# EAGLE design rpi-clock-33v (EAGLE 7.3.0)
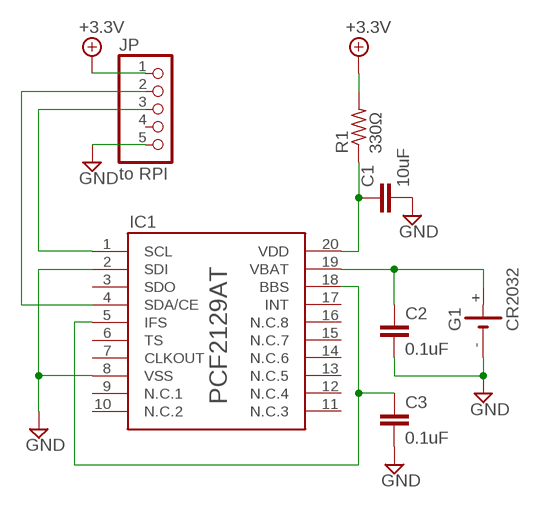
[diagram p0: schematic, sheet 1]

## Parts
C1  10uF  C-EUC0504  [C0504]
C2  0.1uF  C-EUC0504  [C0504]
C3  0.1uF  C-EUC0504  [C0504]
G1  CR2032  HU2032  [HU2032]
IC1  PCF2129AT  [SO20]
JP  to RPI  PINHD-1X5  [1X05]
R1  330Ω  R-US_M0805  [M0805]

## Nets
+3V: JP.1 R1.2 ; supply symbol labelled +3.3V
GND: C1.2 C2.2 C3.2 G1.- IC1.2(SDI) IC1.8(VSS) JP.5
N$1: C1.1 IC1.20(VDD) R1.1
N$2: C3.1 IC1.5(IFS) IC1.18(BBS)
N$10: C2.1 G1.+ IC1.19(VBAT)
N$35: IC1.1(SCL) JP.3
SCL: IC1.4(SDA/CE) JP.2
Unconnected: G1.+@2(+) IC1.3(SDO) IC1.6(TS) IC1.7(CLKOUT) IC1.9(N.C.1) IC1.10(N.C.2) IC1.11(N.C.3) IC1.12(N.C.4) IC1.13(N.C.5) IC1.14(N.C.6) IC1.15(N.C.7) IC1.16(N.C.8) IC1.17(INT) JP.4

## Library data of the parts
C1-C3 = rcl:C-EU: CAPACITOR, European symbol
G1 = takachi-battery-holder:HU2032: TAKACHI - Battery Holder - HU2032
IC1 = nxp_pcf212X:PCF2129AT: Accurate RTC with integrated quartz crystal for industrial applications
JP = pinhead:PINHD-1X5: PIN HEADER
R1 = rcl:R-US_: RESISTOR, American symbol

## Board
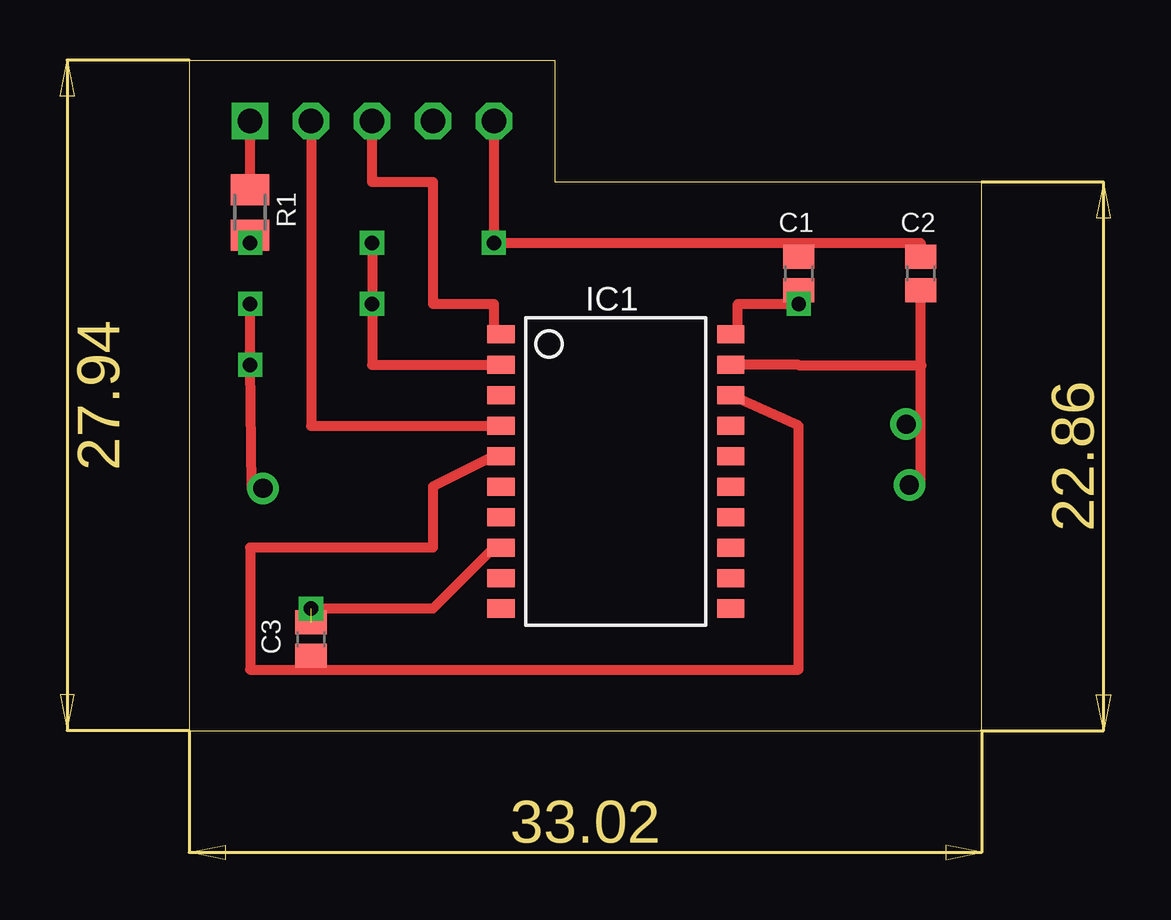
[diagram p1: board, top side]
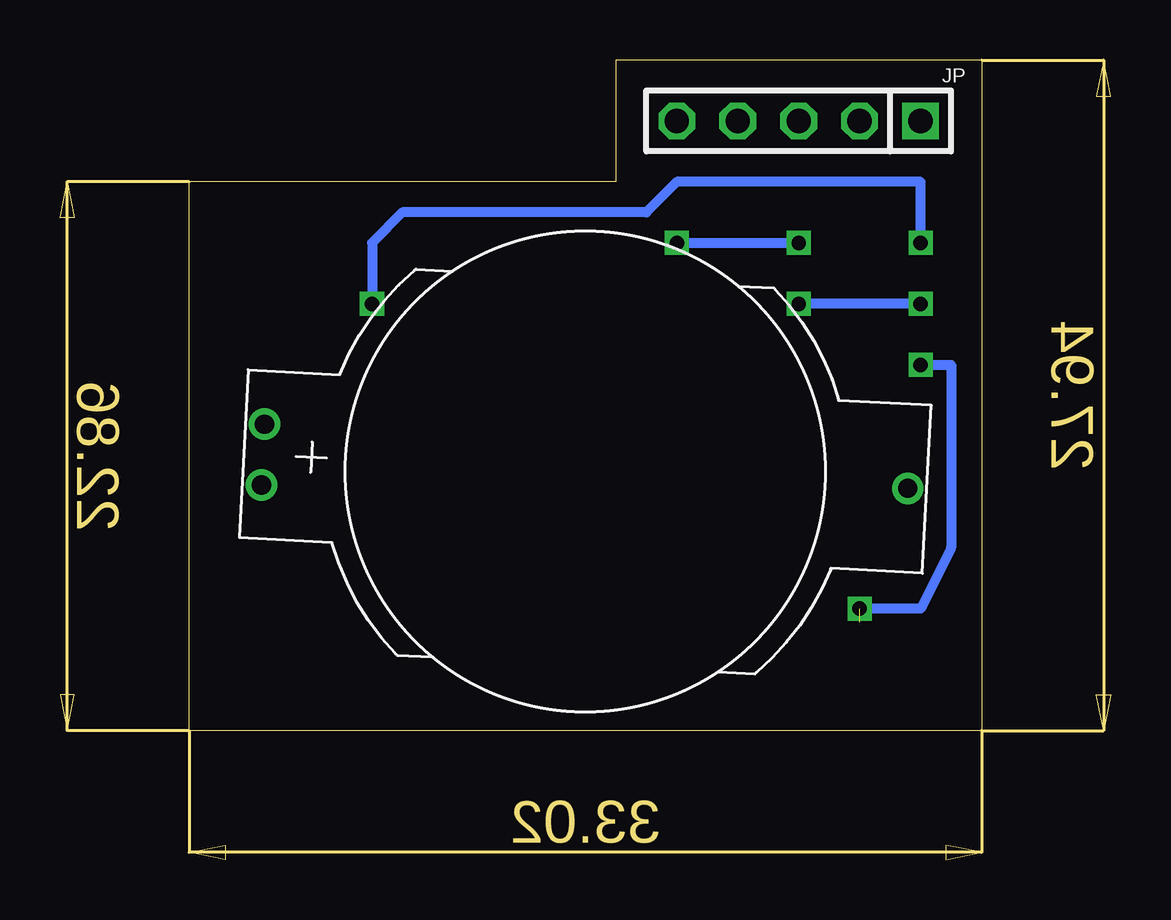
[diagram p2: board, bottom side, seen from below]

Size 33.02 x 27.94 mm. Coordinates in mm from the lower left corner, seen from the top.
Outline: 0,0 33.02,0 33.02,22.86 15.24,22.86 15.24,27.94 0,27.94 0,0
Copper layers (1*16): Top 0.035mm / dielectric 1.5mm / Bottom 0.035mm
Design rules "default *": minimum track width 10mil, minimum drill 23mil, track to track 8mil, track to pad 8mil, pad to pad 8mil, via to via 8mil, smd to smd 8mil, copper to edge 40mil, drill to drill 8mil, minimum pad ring 10mil, minimum via ring 8mil, stop-mask expansion 4mil, vias tented up to drill 0mil, thermal gap 10mil

### Footprints (pad centres in the part's own frame; a part is rotated, then mirrored left to right if it is on the bottom)
C0504 = smd 1 x 1.3: 1 -0.7,0; 2 0.7,0
HU2032 = drill 0.8: + -13.45,1.27; +@2 -13.45,-1.27; - 13.45,0
SO20 = smd 0.762 x 1.143: 1 -5.08,-4.788; 2 -3.81,-4.788; 3 -2.54,-4.788; 4 -1.27,-4.788; 5 0,-4.788; 6 1.27,-4.788; 7 2.54,-4.788; 8 3.81,-4.788; 9 5.08,-4.788; 10 6.35,-4.788; 11 6.35,4.788; 12 5.08,4.788; 13 3.81,4.788; 14 2.54,4.788; 15 1.27,4.788; 16 0,4.788; 17 -1.27,4.788; 18 -2.54,4.788; 19 -3.81,4.788; 20 -5.08,4.788
1X05 = drill 1.016 square: 1 -5.08,0 | drill 1.016 octagon: 2 -2.54,0; 3 0,0; 4 2.54,0; 5 5.08,0
M0805 = smd 1.3 x 1.6: 1 -0.95,0; 2 0.95,0

### Placement (x,y rotation side)
C1  25.4,19.05 90 top
C2  30.48,19.05 90 top
C3  5.08,3.81 90 top
G1  16.51,10.79 357 bottom
IC1  17.78,11.43 270 top
JP  7.62,25.4 180 bottom
R1  2.54,21.59 90 top

### Tracks (layer width: path | path; a pad name or v marks a point on that pad's centre or on a via)
+3V
  Top 0.406: R1.2 JP.1
GND  (via drill 0.6)  (1 unrouted)
  Top 0.406: JP.5 v12.7,20.32 25.4,20.32 | 25.4,20.32 30.48,20.32 C2.2 | v7.62,20.32 v7.62,17.78 7.62,15.24 IC1.2 | IC1.8 12.7,7.62 10.16,5.08 v5.08,5.08 | G1.- 2.61,10.09 v2.54,15.24 v2.54,17.78 | C1.2 25.4,20.32
  Bottom 0.406: v12.7,20.32 v7.62,20.32 | v2.54,15.24 1.27,15.24 1.27,7.62 2.54,5.08 v5.08,5.08 | v2.54,17.78 v7.62,17.78
N$1  (via drill 0.6)
  Top 0.406: C1.1 v25.4,17.78 22.86,17.78 22.86,16.51 IC1.20 | R1.1 v2.54,20.32
  Bottom 0.406: v2.54,20.32 2.54,22.86 12.7,22.86 13.97,21.59 24.13,21.59 25.4,20.32 v25.4,17.78
N$2
  Top 0.406: IC1.5 12.7,11.43 10.16,10.16 10.16,7.62 2.54,7.62 2.54,2.54 5.08,2.54 | 5.08,2.54 25.4,2.54 25.4,12.7 IC1.18 | C3.1 5.08,2.54
N$10
  Top 0.406: G1.+ 30.48,12.7 | 30.48,12.7 30.48,15.21 | 30.48,15.21 25.43,15.21 25.4,15.24 IC1.19 | 30.48,12.7 30.48,10.16 29.84,10.16 | 30.51,15.21 30.48,15.21 | 30.48,15.21 C2.1
N$35
  Top 0.406: IC1.1 12.7,16.8 12.7,17.78 10.16,17.78 10.16,22.86 7.62,22.86 JP.3
SCL
  Top 0.406: IC1.4 5.08,12.7 JP.2